# Altium schematic sheet 2040.SchDoc
size B; Organization: Altium Limited; Address1: L3, 12a Rodborough Rd; Address2: Frenchs Forest; Address3: NSW; Address4: Australia 2086
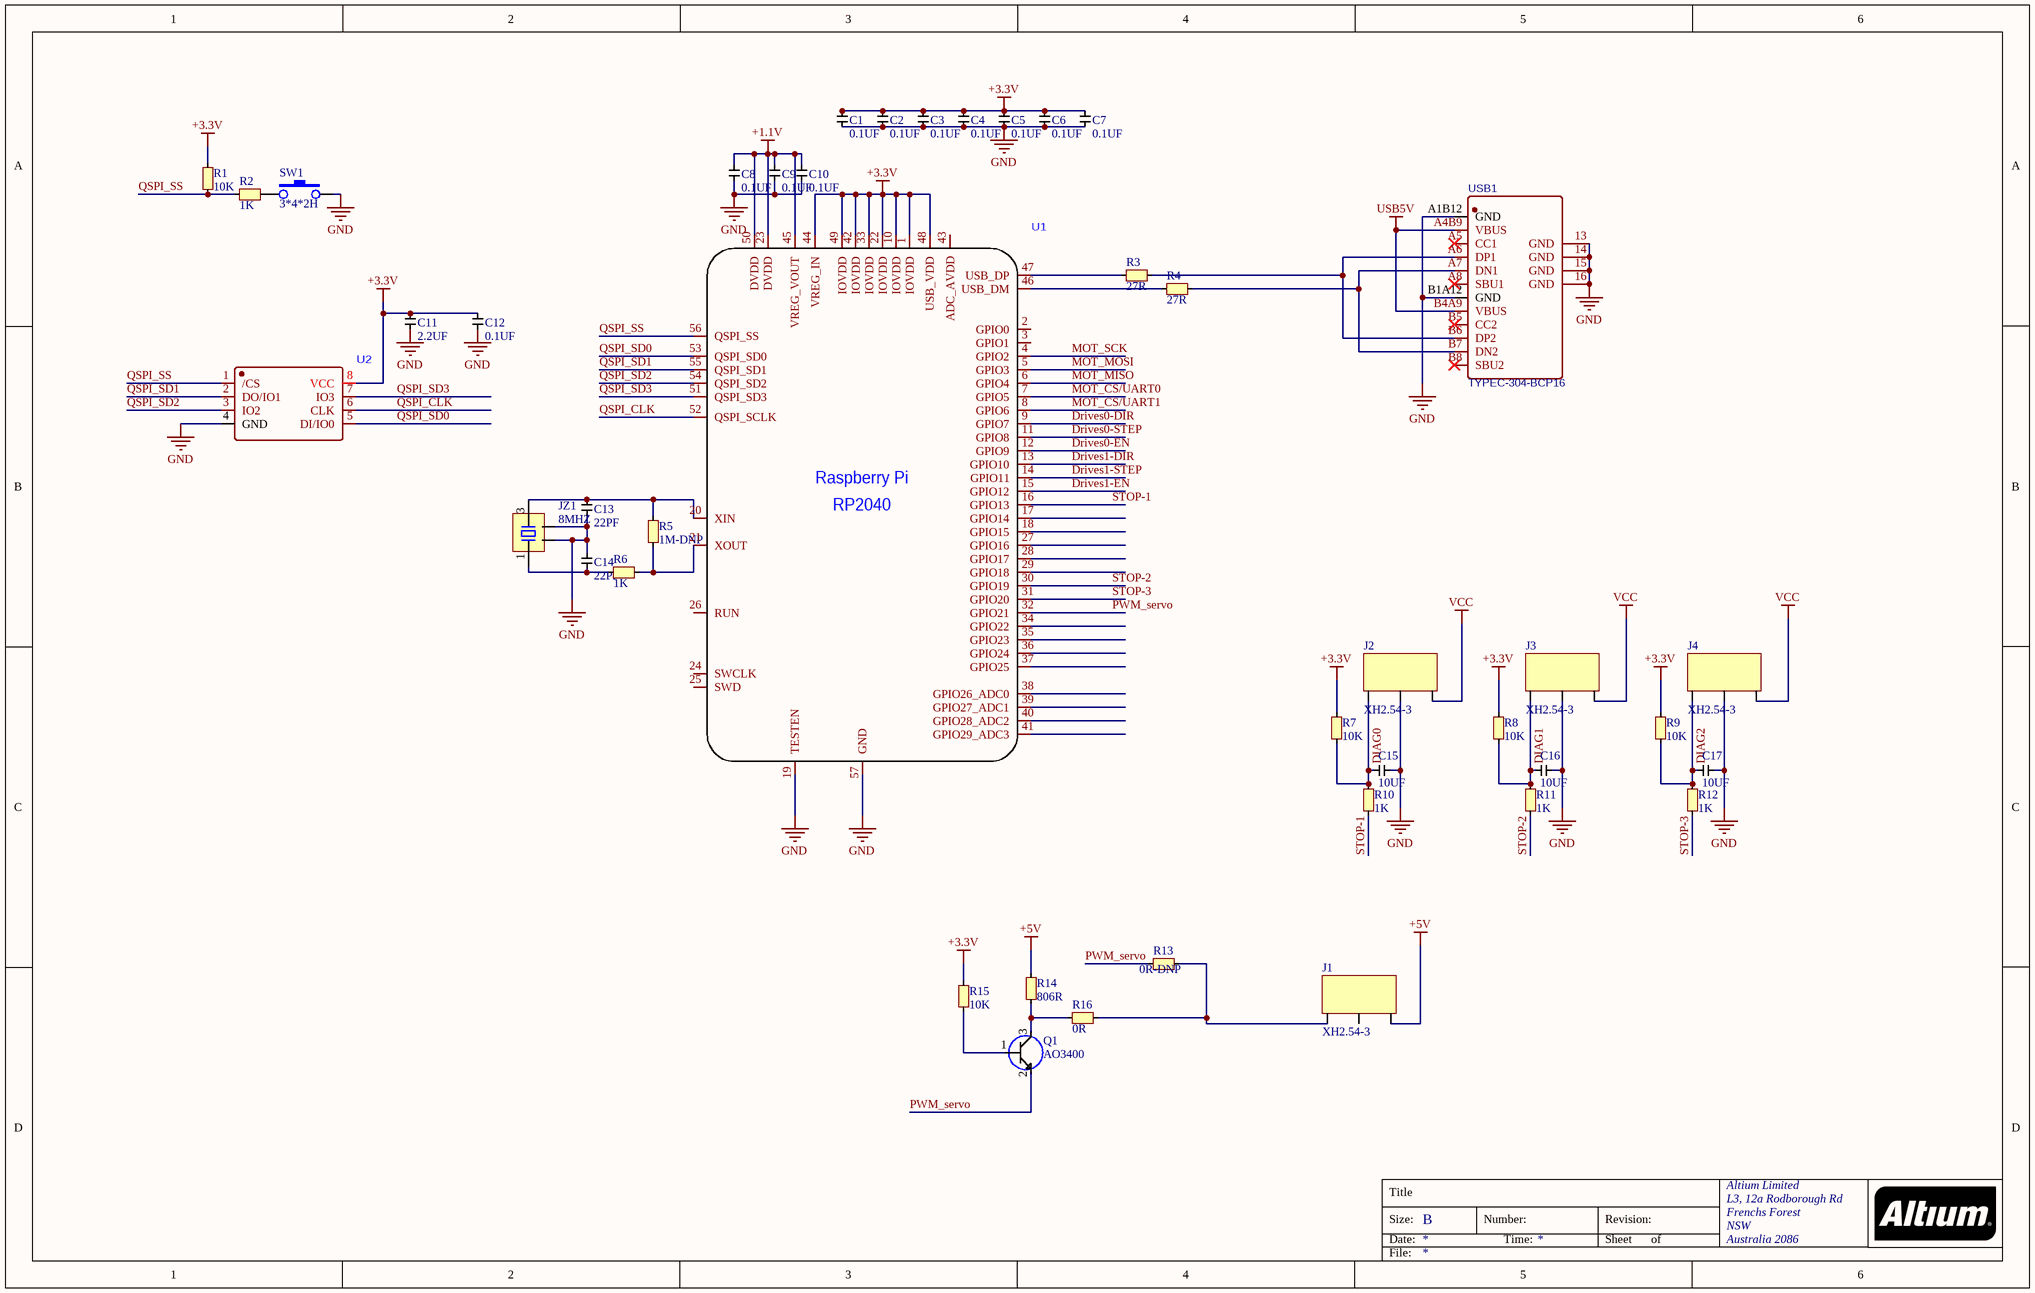
[diagram p0: 2040.SchDoc]

## Parts
C1  0.1UF  [C0402]
C2  0.1UF  [C0402]
C3  0.1UF  [C0402]
C4  0.1UF  [C0402]
C5  0.1UF  [C0402]
C6  0.1UF  [C0402]
C7  0.1UF  [C0402]
C8  0.1UF  [C0402]
C9  0.1UF  [C0402]
C10  0.1UF  [C0402]
C11  2.2UF  [C0402]
C12  0.1UF  [C0402]
C13  22PF  [0603C]
C14  22PF  [0603C]
C15  10UF  [0603C]
C16  10UF  [0603C]
C17  10UF  [0603C]
J1  XH2.54-3  [JST_XH_B3B-XH-A_1X03_P2.50MM_VERTICAL]
J2  XH2.54-3  [JST_XH_B3B-XH-A_1X03_P2.50MM_VERTICAL]
J3  XH2.54-3  [JST_XH_B3B-XH-A_1X03_P2.50MM_VERTICAL]
J4  XH2.54-3  [JST_XH_B3B-XH-A_1X03_P2.50MM_VERTICAL]
JZ1  8MHZ  [OSC-3225-4P]
Q1  AO3400  [SOT-23]
R1  10K  [0603]
R2  1K  [0603]
R3  27R  [R0402]
R4  27R  [R0402]
R5  1M-DNP  [0603]
R6  1K  [0603]
R7  10K  [0603]
R8  10K  [0603]
R9  10K  [0603]
R10  1K  [0603]
R11  1K  [0603]
R12  1K  [0603]
R13  0R-DNP  [0603]
R14  806R  [0603]
R15  10K  [0603]
R16  0R  [0603]
SW1  3*4*2H  [K]
U1  (no value)  [RP2040]
U2  (no value)  [SOP-8]
USB1  TYPEC-304-BCP16  [USB-C-SMD_TYPEC-304-BCP16]

## Nets
+1.1V: C8.1 C9.1 C10.1 U1.23(DVDD) U1.45(VREG_VOUT) U1.50(DVDD)
+3.3V: C1.1 C2.1 C3.1 C4.1 C5.1 C6.1 C7.1 C11.1 C12.1 R1.1 R7.2 R8.2 R9.2 R15.1 U1.1(IOVDD) U1.10(IOVDD) U1.22(IOVDD) U1.33(IOVDD) U1.42(IOVDD) U1.44(VREG_IN) U1.48(USB_VDD) U1.49(IOVDD) U2.8(VCC)
+5V: J1.3 R14.2
GND: C1.2 C2.2 C3.2 C4.2 C5.2 C6.2 C7.2 C8.2 C9.2 C10.2 C11.2 C12.2 C13.2 C14.1 C15.1 C16.1 C17.1 J2.2 J3.2 J4.2 JZ1.2 JZ1.4 SW1.2 U1.19(TESTEN) U1.57(GND) U2.4(GND) USB1.13(GND) USB1.14(GND) USB1.15(GND) USB1.16(GND) USB1.A1B12(GND) USB1.B1A12(GND)
USB5V: USB1.A4B9(VBUS) USB1.B4A9(VBUS)
VCC: J2.3 J3.3 J4.3
DIAG0: C15.2 J2.1 R7.1 R10.2
DIAG1: C16.2 J3.1 R8.1 R11.2
DIAG2: C17.2 J4.1 R9.1 R12.2
Drives0-DIR: U1.9(GPIO7)
Drives0-EN: U1.12(GPIO9)
Drives0-STEP: U1.11(GPIO8)
Drives1-DIR: U1.13(GPIO10)
Drives1-EN: U1.15(GPIO12)
Drives1-STEP: U1.14(GPIO11)
MOT_CS/UART0: U1.7(GPIO5)
MOT_CS/UART1: U1.8(GPIO6)
MOT_MISO: U1.6(GPIO4)
MOT_MOSI: U1.5(GPIO3)
MOT_SCK: U1.4(GPIO2)
PWM_servo: Q1.2 R13.2 U1.32(GPIO21)
QSPI_CLK: U1.52(QSPI_SCLK) U2.6(CLK)
QSPI_SD0: U1.53(QSPI_SD0) U2.5(DI/IO0)
QSPI_SD1: U1.55(QSPI_SD1) U2.2(DO/IO1)
QSPI_SD2: U1.54(QSPI_SD2) U2.3(IO2)
QSPI_SD3: U1.51(QSPI_SD3) U2.7(IO3)
QSPI_SS: R1.2 R2.1 U1.56(QSPI_SS) U2.1(/CS)
STOP-1: R10.1 U1.16(GPIO13)
STOP-2: R11.1 U1.30(GPIO19)
STOP-3: R12.1 U1.31(GPIO20)
NetC13_1: C13.1 JZ1.3 R5.2 U1.20(XIN)
NetC14_2: C14.2 JZ1.1 R6.2
NetJ1_1: J1.1 R13.1 R16.1
NetQ1_1: Q1.1 R15.2
NetQ1_3: Q1.3 R14.1 R16.2
NetR2_2: R2.2 SW1.1
NetR3_1: R3.1 U1.47(USB_DP)
NetR3_2: R3.2 USB1.A6(DP1) USB1.B6(DP2)
NetR4_1: R4.1 U1.46(USB_DM)
NetR4_2: R4.2 USB1.A7(DN1) USB1.B7(DN2)
NetR5_1: R5.1 R6.1 U1.21(XOUT)

Not connected (* = marked no-connect by the designer): J1 2; U1 2(GPIO0) 3(GPIO1) 17(GPIO14) 18(GPIO15) 24(SWCLK) 25(SWD) 26(RUN) 27(GPIO16) 28(GPIO17) 29(GPIO18) 34(GPIO22) 35(GPIO23) 36(GPIO24) 37(GPIO25) 38(GPIO26_ADC0) 39(GPIO27_ADC1) 40(GPIO28_ADC2) 41(GPIO29_ADC3) 43(ADC_AVDD); USB1 A5(CC1)* A8(SBU1)* B5(CC2)* B8(SBU2)*

## Notes on the sheet
- Title
- Size:
- Date:
- B
- Number:
- Time:
- Revision:
- Sheet
- of
- File:
- (in symbol RP2040) Raspberry Pi

## Library data of the parts
C1-C12 = C
C13-C17 = 0603C
JZ1 = JZ3225
Q1 = S8050
R1 R2 R5-R12 = 0603R
R3 R4 R13-R16 = R
SW1 = RESET
U1 = RP2040
U2 = W25Q16JVSSIQ
USB1 = TYPEC-304-BCP16: BOM_Manufacturer: XUNPU; Contributor: LCSC; BOM_Supplier: LCSC; BOM_Supplier Part: C720629; BOM_Manufacturer Part: TYPEC-304-BCP16; spicePre: U; spiceSymbolName: TYPEC-304-BCP16